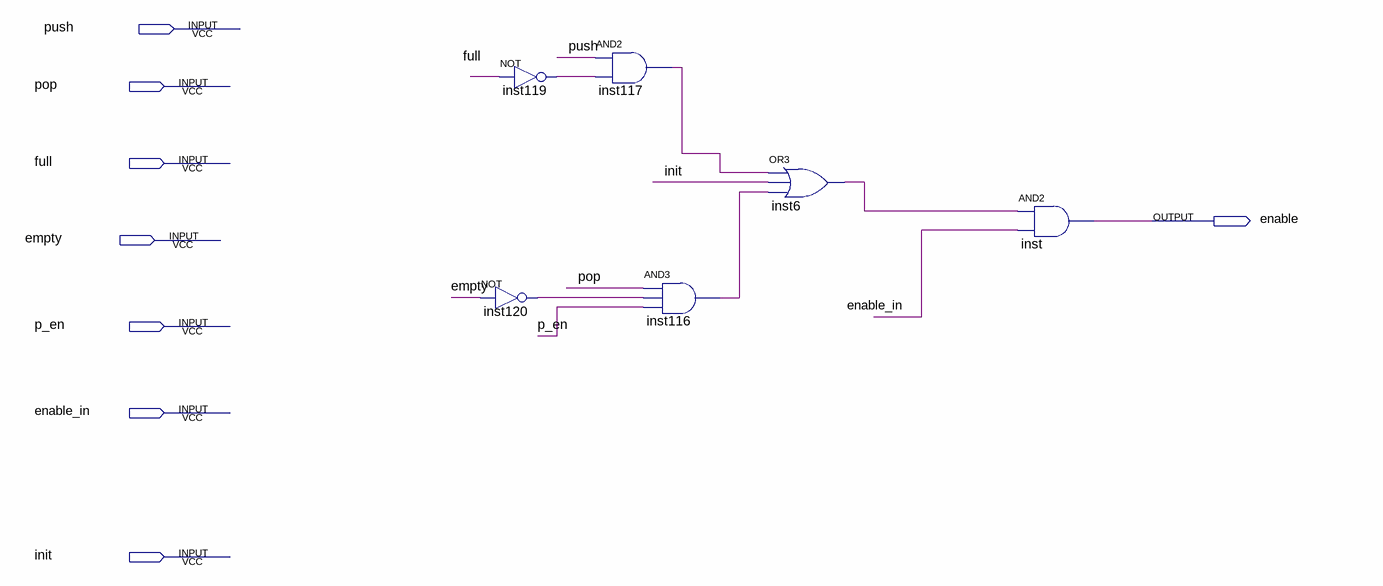
[diagram p0: schematic sheet]
// Quartus schematic g54_enableLogic.bdf as structural Verilog: 6 symbols, 8 pins
module g54_enableLogic (
  input  push,
  input  pop,
  input  full,
  input  empty,
  input  p_en,
  input  enable_in,
  input  init,
  output enable
);

  wire inst6_out, inst116_out, inst117_out, inst119_out, inst120_out;

  not inst119 (inst119_out, full);
  not inst120 (inst120_out, empty);
  and inst117 (inst117_out, push, inst119_out);
  and inst116 (inst116_out, pop, inst120_out, p_en);
  or inst6 (inst6_out, inst117_out, init, inst116_out);
  and inst (enable, inst6_out, enable_in);
endmodule
